# EAGLE design YOTSUBA_GNSS-receiver_MAX_ver.1.4.1 (EAGLE 9.6.2)
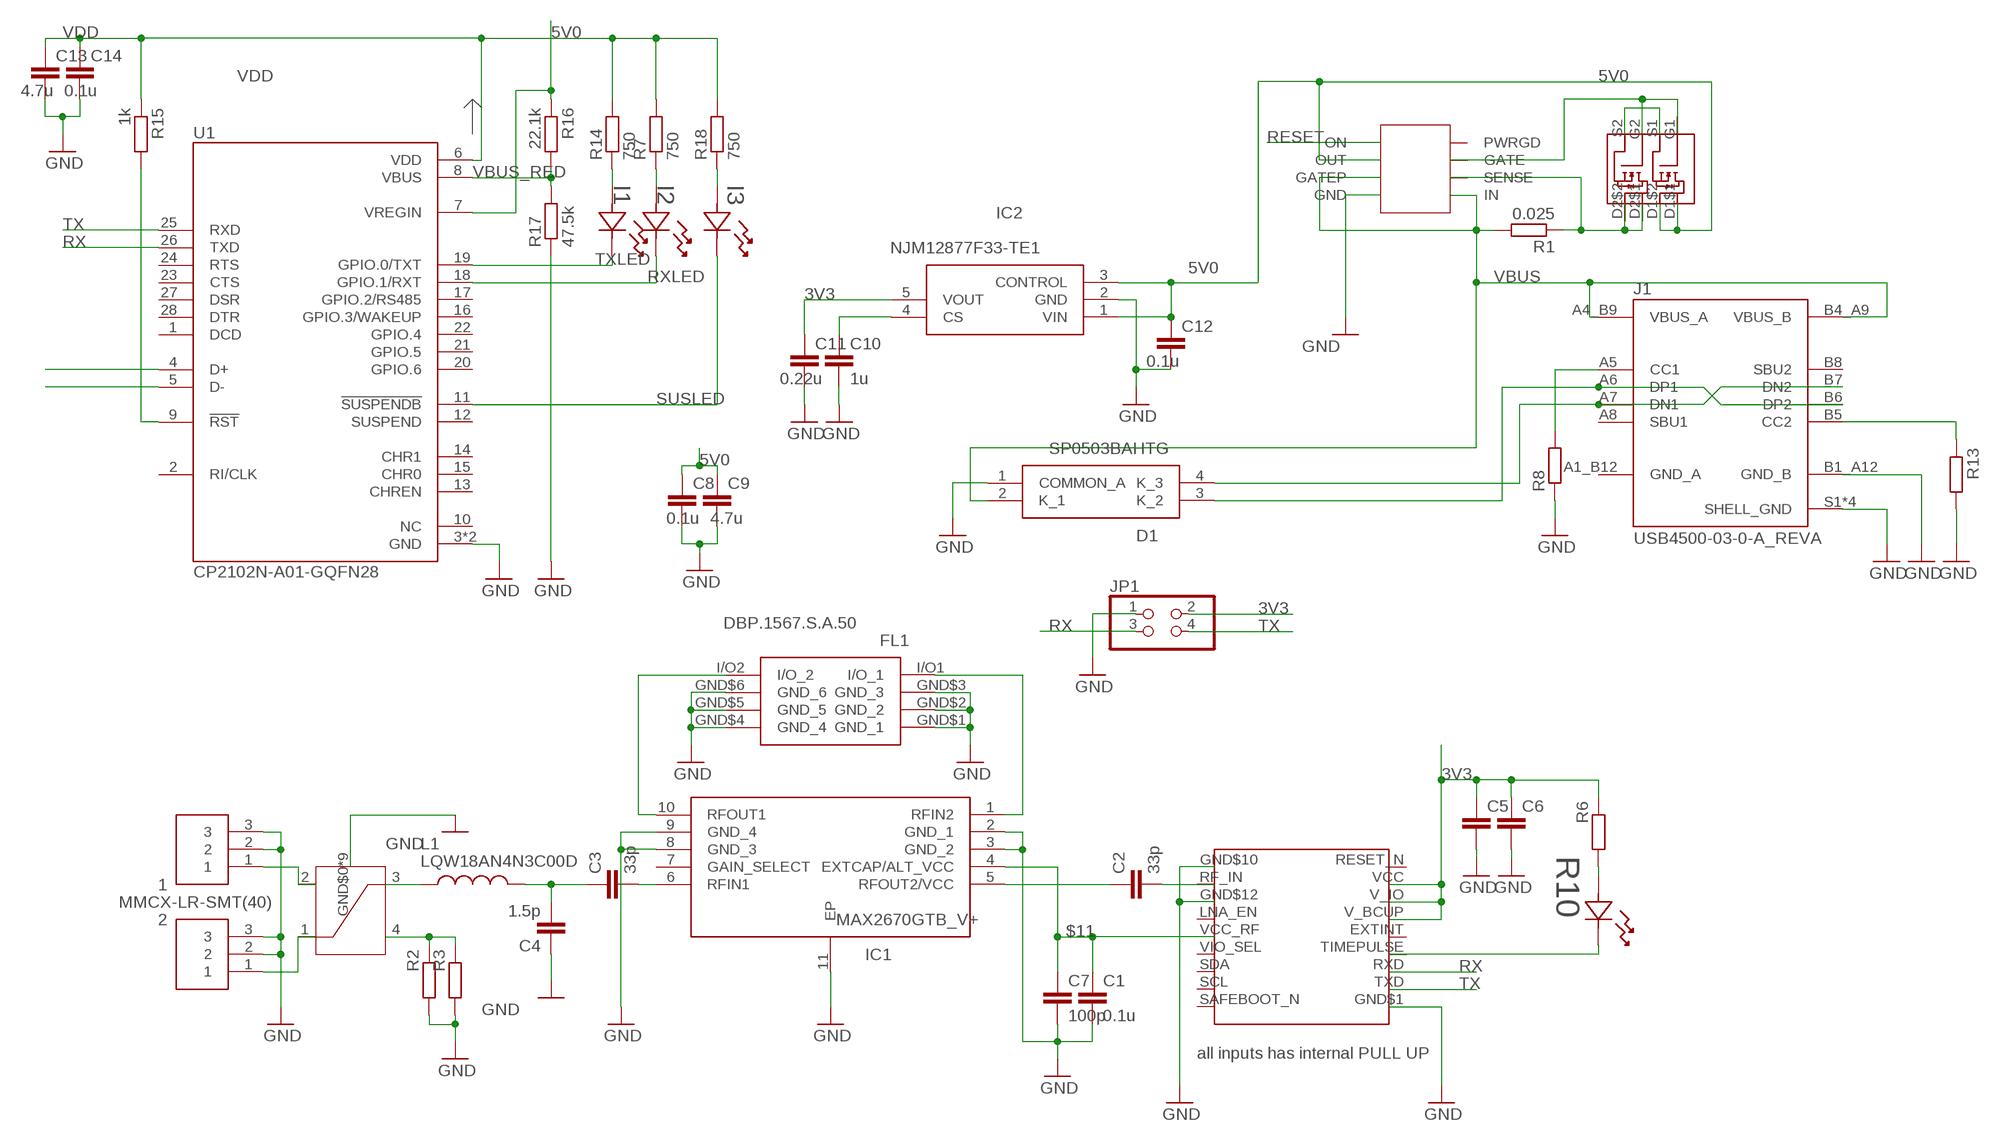
[diagram p0: schematic, sheet 1]

## Parts
1  MMCX-LR-SMT(40)  [MMCX-LR-SMT(40)]
2  MMCX-LR-SMT(40)  [MMCX-LR-SMT(40)]
C1  0.1u  C-EUC1608  [C1608]
C2  33p  C-EUC1608  [C1608]
C3  33p  C-EUC1608  [C1608]
C4  1.5p  C-EUC1608  [C1608]
C5  C-EUC1608  [C1608]
C6  C-EUC1608  [C1608]
C7  100p  C-EUC1608  [C1608]
C8  0.1u  C-EUC1608  [C1608]
C9  4.7u  C-EUC1608  [C1608]
C10  1u  C-EUC1608  [C1608]
C11  0.22u  C-EUC1608  [C1608]
C12  0.1u  C-EUC1608  [C1608]
C13  4.7u  C-EUC1608  [C1608]
C14  0.1u  C-EUC1608  [C1608]
D1  SP0503BAHTG  [SP0503BAHTG]
FL1  DBP.1567.S.A.50  [DBP1567SA50]
I1  SML-E12P8WT86  [LED_SMLD12_ROM]
I2  SML-E12P8WT86  [LED_SMLD12_ROM]
I3  SML-E12P8WT86  [LED_SMLD12_ROM]
IC1  MAX2670GTB_V+  [SON50P300X300X80-11N]
IC2  NJM12877F33-TE1  [SOT95P280X120-5N]
J1  USB4500-03-0-A_REVA  [GCT_USB4500-03-0-A_REVA]
JP1  PINHD-2X2  [2X02]
L1  LQW18AN4N3C00D  [INDC1608X100N]
R1  0.025  R-EU_R0603  [R0603]
R2  R-EU_R0603  [R0603]
R3  R-EU_R0603  [R0603]
R6  R-EU_R0603  [R0603]
R7  750  R-EU_R0603  [R0603]
R8  R-EU_R0603  [R0603]
R10  SML-E12P8WT86  [LED_SMLD12_ROM]
R13  R-EU_R0603  [R0603]
R14  750  R-EU_R0603  [R0603]
R15  1k  R-EU_R0603  [R0603]
R16  22.1k  R-EU_R0603  [R0603]
R17  47.5k  R-EU_R0603  [R0603]
R18  750  R-EU_R0603  [R0603]
U1  CP2102N-A01-GQFN28  [QFN50P500X500X80-29N]
U$1  MAX_M10S  [MAX-M10S]
U$3  HC125.A  [HC125.A]
U$7  DMG6898LSD  [SOIC127P600X150-8N]
U$8  LTC4361  [SOP65P280X100-8N]

## Nets
3V3 [POWER]: C5.1 C6.1 C11.1 IC2.5(VOUT) JP1.2 R6.2 U$1.V_BCUP(V_BCKP) U$1.V_IO U$1.VCC
5V0 [POWER]: C8.1 C9.1 C12.1 IC2.1(VIN) IC2.3(CONTROL) R16.1 U1.7(VREGIN) U$7.D1$1 U$7.D1$2 U$8.OUT
$11 [POWER]: C1.1 C7.1 IC1.4(EXTCAP/ALT_VCC) U$1.VCC_RF
D+: D1.3(K_2) J1.A6(DP1) J1.B6(DP2) U1.4(D+)
D-: D1.4(K_3) J1.A7(DN1) J1.B7(DN2) U1.5(D-)
GND [gnd]: 1.2 1.3 2.2 2.3 C1.2 C4.1 C5.2 C6.2 C7.2 C8.2 C9.2 C10.2 C11.2 C12.2 C13.2 C14.2 D1.1(COMMON_A) FL1.GND$1(GND_1) FL1.GND$2(GND_2) FL1.GND$3(GND_3) FL1.GND$4(GND_4) FL1.GND$5(GND_5) FL1.GND$6(GND_6) IC1.2(GND_1) IC1.3(GND_2) IC1.8(GND_3) IC1.9(GND_4) IC1.11(EP) IC2.2(GND) J1.B1_A12(GND_B) J1.S1(SHELL_GND) J1.S2(SHELL_GND) J1.S3(SHELL_GND) J1.S4(SHELL_GND) JP1.1 R2.1 R3.1 R8.1 R13.2 R17.1 U1.3(GND) U1.29(GND) U$1.GND$1 U$1.GND$10 U$1.GND$12 U$3.GND$0(GND) U$3.GND$1(GND) U$3.GND$2(GND) U$3.GND$3(GND) U$3.GND$4(GND) U$3.GND$5(GND) U$3.GND$6(GND) U$3.GND$7(GND) U$3.GND$8(GND) U$8.GND
N$1 [1.1mm]: 1.1 U$3.2
N$2 [1.1mm]: 2.1 U$3.1
N$4: C10.1 IC2.4(CS)
N$5: I2.2 R7.1
N$6 [50Ω]: R2.2 R3.2 U$3.4
N$7: L1.1 U$3.3
N$8 [50Ω]: FL1.I/O2(I/O_2) IC1.10(RFOUT1)
N$9 [50Ω]: FL1.I/O1(I/O_1) IC1.1(RFIN2)
N$10: C3.1 C4.2 L1.2
N$11 [50Ω]: C2.1 IC1.5(RFOUT2/VCC)
N$12 [50Ω]: C2.2 U$1.RF_IN
N$13: I1.2 R14.1
N$14: R10.1 U$1.TIMEPULSE
N$15: R6.1 R10.2
N$16: I3.2 R18.1
N$18: C3.2 IC1.6(RFIN1)
N$19: U$7.S1 U$7.S2
N$20: R1.1 U$7.D2$1 U$7.D2$2 U$8.SENSE
N$21: J1.B5(CC2) R13.1
N$22: U$7.G1 U$7.G2 U$8.GATE
N$23: J1.A5(CC1) R8.2
N$27: R15.2 U1.9(!RST)
RESET [gnd]: U$8.ON
RX: JP1.3 U1.26(TXD) U$1.RXD
RXLED: I2.1 U1.18(GPIO.1/RXT)
SUSLED: I3.1 U1.11(!SUSPENDB)
TX: JP1.4 U1.25(RXD) U$1.TXD
TXLED: I1.1 U1.19(GPIO.0/TXT)
VBUS: D1.2(K_1) J1.A4_B9(VBUS_A) J1.B4_A9(VBUS_B) R1.2 U$8.GATEP U$8.IN
VBUS_RED: R16.2 R17.2 U1.8(VBUS)
VDD: C13.1 C14.1 R7.2 R14.2 R15.1 R18.2 U1.6(VDD)
Unconnected: IC1.7(GAIN_SELECT) J1.A8(SBU1) J1.B8(SBU2) U1.1(DCD) U1.2(RI/CLK) U1.10(NC) U1.12(SUSPEND) U1.13(CHREN) U1.14(CHR1) U1.15(CHR0) U1.16(GPIO.3/WAKEUP) U1.17(GPIO.2/RS485) U1.20(GPIO.6) U1.21(GPIO.5) U1.22(GPIO.4) U1.23(CTS) U1.24(RTS) U1.27(DSR) U1.28(DTR) U$1.EXTINT U$1.LNA_EN U$1.RESET_N U$1.SAFEBOOT_N U$1.SCL U$1.SDA U$1.VIO_SEL U$8.PWRGD

## Notes on the sheet
- all inputs has internal PULL UP

## Power pins joined to a net without a drawn wire
GND: J1.A1_B12(GND_A)

## Library data of the parts
1 2 = MMCX-LR-SMT(40):MMCX-LR-SMT(40)
C1-C14 = rcl:C-EU: CAPACITOR, European symbol; SPICEPREFIX: C
D1 = SamacSys_Parts:SP0503BAHTG: ESD Suppressors / TVS Diodes TVS AVAL DIODE SMT Source: Datasheet <https://nl.mouser.com/datasheet/2/240/Littelfuse_TVS_Diode_Array_SP05_Datasheet.pdf-777043.pdf>; ARROW_PART_NUMBER: SP0503BAHTG; ARROW_PRICE-STOCK: https://www.arrow.com/en/products/sp0503bahtg/littelfuse?region=europe; DESCRIPTION: ESD Suppressors / TVS Diodes TVS AVAL DIODE SMT; HEIGHT: 1.22mm; MANUFACTURER_NAME: LITTELFUSE; MANUFACTURER_PART_NUMBER: SP0503BAHTG; MOUSER_PART_NUMBER: 576-SP0503BAHTG; MOUSER_PRICE-STOCK: https://www.mouser.co.uk/ProductDetail/Littelfuse/SP0503BAHTG?qs=uD%2FdkN7XIa0NTYXwHdELYA%3D%3D
FL1 = DBP.1567.S.A.50:DBP.1567.S.A.50: Ceramic Filters Band Pass 1567.5MHz 1dB 50Ohm SMD 2Pin Source: Datasheet <https://www.taoglas.com/datasheets/DBP.1567.S.A.50.pdf>; DESCRIPTION: Ceramic Filters Band Pass 1567.5MHz 1dB 50Ohm SMD 2Pin; HEIGHT: 4.2mm; MANUFACTURER_NAME: Taoglas; MANUFACTURER_PART_NUMBER: DBP.1567.S.A.50
I1-I3 R10 = LED_1608_2:SML-E12P8WT86; COPYRIGHT: Copyright (C) 2023 Ultra Librarian. All rights reserved.; DIGI-KEY_PART_NUMBER_1: 511-1585-1-ND; DIGI-KEY_PART_NUMBER_2: 511-1585-2-ND; DIGI-KEY_PART_NUMBER_3: 511-1585-6-ND; MANUFACTURER_PART_NUMBER: SML-E12P8WT86; MFR_NAME: ROHM Semiconductor
IC1 = MAX2670GTB_V+:MAX2670GTB_V+: RF Amplifier GPS/GNSS Front End Amplifier Source: Datasheet <https://componentsearchengine.com/Datasheets/1/MAX2670GTB_V .pdf>; DESCRIPTION: RF Amplifier GPS/GNSS Front End Amplifier; HEIGHT: 0.8mm; MANUFACTURER_NAME: Analog Devices; MANUFACTURER_PART_NUMBER: MAX2670GTB/V+; MOUSER_PART_NUMBER: 700-MAX2670GTB/V+; MOUSER_PRICE-STOCK: https://www.mouser.com/Search/Refine.aspx?Keyword=700-MAX2670GTB%2FV%2B
IC2 = SamacSys_Parts:NJM12877F33-TE1: LDO Voltage Regulators LDO ADJ High Ripple 3.3V Vo 1% 200mA Source: Datasheet <https://datasheet.datasheetarchive.com/originals/distributors/Datasheets_SAMA/e828f6bebe4b9138c37698b69374413c.pdf>; DESCRIPTION: LDO Voltage Regulators LDO ADJ High Ripple 3.3V Vo 1% 200mA; HEIGHT: 1.2mm; MANUFACTURER_NAME: New Japan Radio; MANUFACTURER_PART_NUMBER: NJM12877F33-TE1; MOUSER_PART_NUMBER: 513-NJM12877F33-TE1; MOUSER_PRICE-STOCK: https://www.mouser.com/Search/Refine.aspx?Keyword=513-NJM12877F33-TE1
J1 = USB4500-03-0-A_REVA:USB4500-03-0-A_REVA; DESCRIPTION: USB-C (USB TYPE-C) USB 2.0 Receptacle Connector 24 (16+8 Dummy) Position Board Edge, Cutout; Surface Mount; Through Hole, Right Angle; DIGI-KEY_PART_NUMBER: 2073-USB4500-03-0-ATR-ND; MF: Global Connector Technology; MP: USB4500-03-0-A; PACKAGE: None; PURCHASE-URL: https://pricing.snapeda.com/search/part/USB4500-03-0-A/?ref=eda
JP1 = pinhead:PINHD-2X2: PIN HEADER
L1 = LQW18AN4N3C00D:LQW18AN4N3C00D: 2.3 NH +/-.1NH; DESCRIPTION: Inductor with Inductance: 4.3nH Tol. +/-0.2nH, Package: 0603 (1608); DIGIKEY_PART_NUMBER: 490-6896-2-ND; MF: Murata; MP: LQW18AN4N3C00D; PACKAGE: 1608 Murata; PURCHASE-URL: https://pricing.snapeda.com/search?q=LQW18AN4N3C00D&ref=eda
R1-R3 R6-R8 R13-R18 = rcl:R-EU_: RESISTOR, European symbol; SPICEPREFIX: R
U1 = CP2102N-A01-GQFN28:CP2102N-A01-GQFN28: USB Bridge, USB to UART USB 2.0 UART Interface 28-QFN (5x5) Check availability <https://pricing.snapeda.com/parts/CP2102N-A01-GQFN28/Silicon%20Labs/view-part?ref=eda>; AVAILABILITY: In Stock; DESCRIPTION: USB Bridge, USB to UART USB 2.0 UART Interface 28-QFN (5x5); MF: Silicon Labs; MP: CP2102N-A01-GQFN28; PACKAGE: QFN-28 Silicon Labs; PRICE: None; PURCHASE-URL: https://pricing.snapeda.com/search/part/CP2102N-A01-GQFN28/?ref=eda
U$1 = MAX-M10S:MAX_M10S
U$3 = HC125.A:HC125.A
U$7 = DMG6898LSD:DMG6898LSD
U$8 = ltc4361:LTC4361

## Net classes
0 default: clearance 0.121 mm
2 gnd: clearance 0.21 mm to class 1, clearance 0.254 mm
3 POWER: width 0.305 mm, clearance 0.025 mm
4 1.1mm: clearance 0.247 mm to class 1

## Board
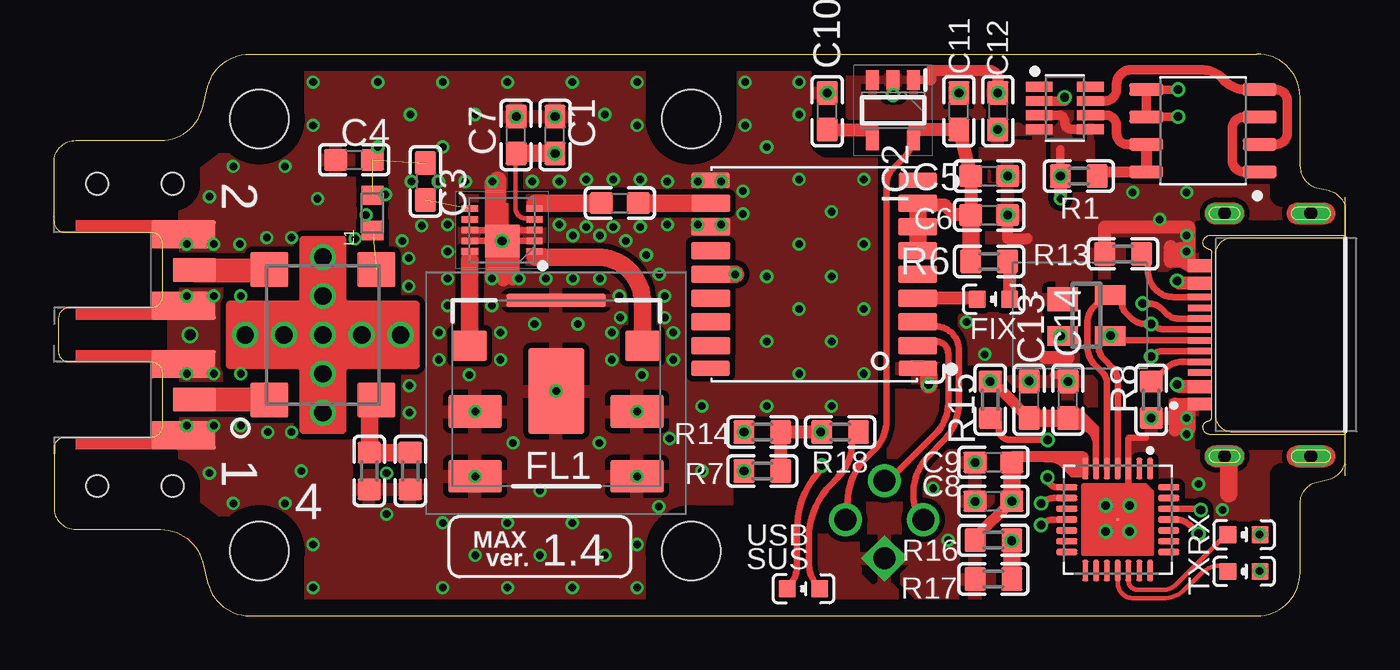
[diagram p1: board, top side]
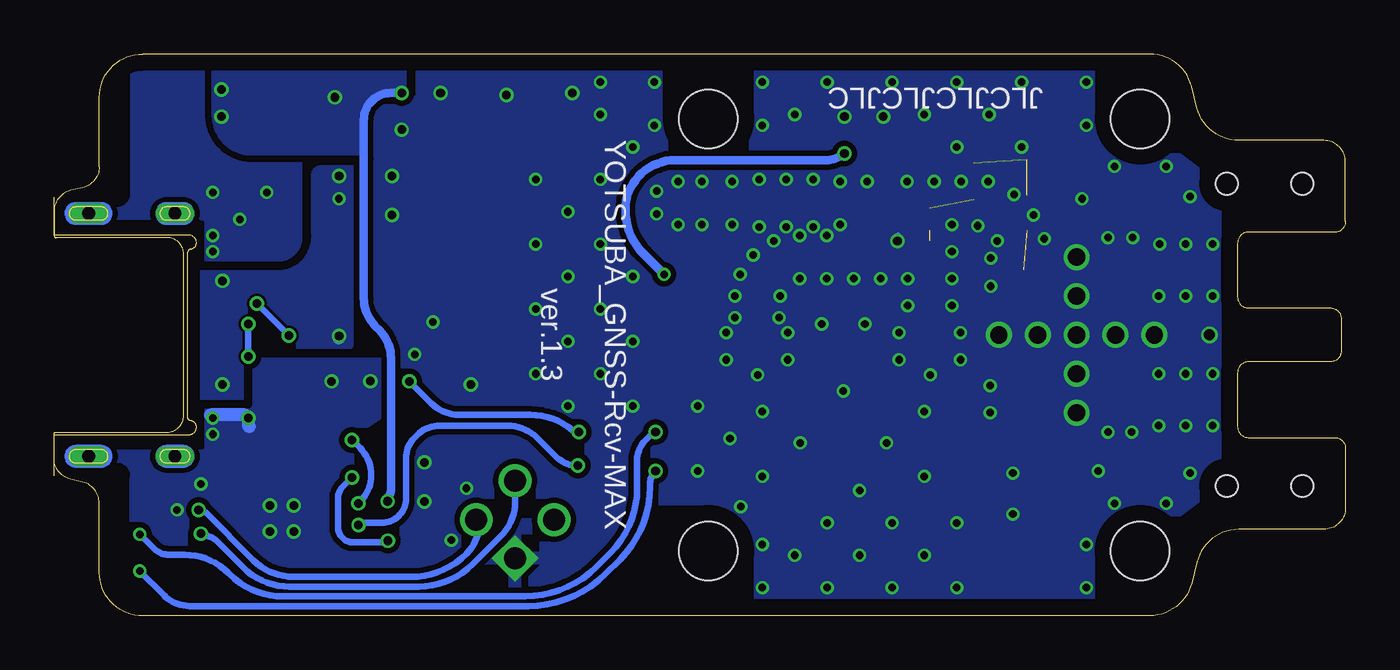
[diagram p2: board, bottom side, seen from below]

Size 59.8 x 26 mm. Coordinates in mm from the lower left corner, seen from the top.
Outline: 1,4 4.94,4 arc-76 6.88,2.48 7.12,1.51 arc76 9.06,0 55.7,0 arc90 57.7,2 57.7,5.21 arc-77 58.47,6.18 59.03,6.32 arc77 59.8,7.29 59.8,8.4 arc90 59.7,8.5 54.55,8.5 arc-90 53.8,9.25 53.8,16.75 arc-90 54.55,17.5 59.7,17.5 arc90 59.8,17.6 59.8,18.71 arc77 59.03,19.68 58.47,19.82 arc-77 57.7,20.79 57.7,24 arc90 55.7,26 9.06,26 arc76 7.12,24.48 6.88,23.52 arc-76 4.94,22 1,22 arc90 0,21 0,18.25 arc90 0.5,17.75 4.5,17.75 arc-90 5,17.25 5,14.75 arc-90 4.5,14.25 0.7,14.25 arc90 0.2,13.75 0.2,12.25 arc90 0.7,11.75 4.5,11.75 arc-90 5,11.25 5,8.75 arc-90 4.5,8.25 0.5,8.25 arc90 0,7.75 0,5 arc90 1,4
Copper layers (1+2*15+16): Top 0.035mm / dielectric 0.1mm / Route2 0.02mm / dielectric 0.77mm / Route15 0.02mm / dielectric 0.1mm / Bottom 0.035mm
Design rules "JLCPCB_2L *": minimum track width 5mil, minimum drill 0.15mm, track to track 5mil, track to pad 5mil, pad to pad 5mil, via to via 5mil, smd to smd 5mil, copper to edge 30mil, drill to drill 0.5mm, minimum pad ring 0.13mm, minimum via ring 0.13mm, stop-mask expansion 0.038mm, vias tented up to drill 0.4mm, thermal gap 10mil
Holes 1 mm at 2,6 5.5,6 2,20 5.5,20
Holes 2.7 mm at 9.5,3 9.5,23 29.5,23 29.5,3
tRestrict: 79 lines
bRestrict: 36 lines

### Footprints (pad centres in the part's own frame; a part is rotated, then mirrored left to right if it is on the bottom)
MMCX-LR-SMT(40) = smd 1.1 x 2: 1 0,-2 | smd 1.3 x 3: 2 1.65,-1.5; 3 -1.65,-1.5
C1608 = smd 1.1 x 1: 1 -0.85,0; 2 0.85,0
SP0503BAHTG = smd 1.1 x 1.4: 1 -0.75,-1.1 | smd 0.9 x 1.4: 2 0.95,-1.1; 3 0.95,1.1; 4 -0.95,1.1
DBP1567SA50 = smd 2.5 x 1.5: GND$1 1.05,6.75; GND$2 1.05,3.75; GND$4 8.55,3.75; GND$5 8.55,6.75 | smd 2.6 x 4: GND$3 4.8,2.8 | smd 4.6 x 0.6: GND$6 4.8,-1.4 | smd 1.6 x 1.4: I/O1 0.8,0.7; I/O2 8.8,0.7
LED_SMLD12_ROM = smd 0.8 x 0.8: 1 -0.75,0; 2 0.75,0
SON50P300X300X80-11N = smd 0.75 x 0.3: 1 -1.5,1; 2 -1.5,0.5; 3 -1.5,0; 4 -1.5,-0.5; 5 -1.5,-1; 6 1.5,-1; 7 1.5,-0.5; 8 1.5,0; 9 1.5,0.5; 10 1.5,1 | smd 1.6 x 1.5: 11 0,0.5
SOT95P280X120-5N = smd 0.9 x 0.6: 1 -1.4,0.95; 2 -1.4,0; 3 -1.4,-0.95; 4 1.4,-0.95; 5 1.4,0.95
GCT_USB4500-03-0-A_REVA = smd 0.6 x 1.1: A1_B12 -3.2,5.15; A4_B9 -2.4,5.15; B1_A12 3.2,5.15; B4_A9 2.4,5.15 | smd 0.3 x 1.1: A5 -1.25,5.15; A6 -0.25,5.15; A7 0.25,5.15; A8 1.25,5.15; B5 1.75,5.15; B6 0.75,5.15; B7 -0.75,5.15; B8 -1.75,5.15 | drill 0.6 pad 0.95 long: S1 -5.62,0; S4 5.62,0 | drill 0.6 pad 0.8 long: S2 5.62,4; S3 -5.62,4
2X02 = drill 1.016 square: 1 -1.27,-1.27 | drill 1.016: 2 -1.27,1.27; 3 1.27,-1.27; 4 1.27,1.27
INDC1608X100N = smd 0.89 x 1.02: 1 -0.814,0; 2 0.814,0
R0603 = smd 1 x 1.1: 1 -0.85,0; 2 0.85,0
QFN50P500X500X80-29N = smd 1.01 x 0.3: 1 -2.36,1.5; 2 -2.36,1; 3 -2.36,0.5; 4 -2.36,0; 5 -2.36,-0.5; 6 -2.36,-1; 7 -2.36,-1.5; 15 2.36,-1.5; 16 2.36,-1; 17 2.36,-0.5; 18 2.36,0; 19 2.36,0.5; 20 2.36,1; 21 2.36,1.5 | smd 0.3 x 1.01: 8 -1.5,-2.36; 9 -1,-2.36; 10 -0.5,-2.36; 11 0,-2.36; 12 0.5,-2.36; 13 1,-2.36; 14 1.5,-2.36; 22 1.5,2.36; 23 1,2.36; 24 0.5,2.36; 25 0,2.36; 26 -0.5,2.36; 27 -1,2.36; 28 -1.5,2.36 | smd 0.127 x 0.127: 29 0,0
MAX-M10S = smd 1.8 x 0.8: EXTINT 4.8,0; GND$12 -4.8,2.2; LNA_EN -4.8,1.1; RF_IN -4.8,3.3; RXD 4.8,-2.2; SCL -4.8,-3.3; SDA -4.8,-2.2; TIMEPULSE 4.8,-1.1; TXD 4.8,-3.3; V_BCUP 4.8,1.1; V_IO 4.8,2.2; VCC 4.8,3.3; VCC_RF -4.8,0; VIO_SEL -4.8,-1.1 | smd 1.8 x 0.7: GND$1 4.8,-4.35; GND$10 -4.8,4.35; RESET_N 4.8,4.35; SAFEBOOT_N -4.8,-4.35
HC125.A = smd 1.625 x 1.75: 1 -3.022,2.475; 2 3.022,2.475; 3 3.022,-2.475; 4 -3.022,-2.475 | drill 0.8: GND$0 0,0; GND$1 0,3.6; GND$2 0,1.8; GND$3 0,-3.6; GND$4 0,-1.8; GND$5 -3.6,0; GND$6 -1.8,0; GND$7 3.6,0; GND$8 1.8,0
SOIC127P600X150-8N = smd 1.58 x 0.589: D1$1 -2.625,1.905; D1$2 -2.625,0.635; D2$1 -2.625,-0.635; D2$2 -2.625,-1.905; G1 2.625,1.905; G2 2.625,-0.635; S1 2.625,0.635; S2 2.625,-1.905
SOP65P280X100-8N = smd 1.237 x 0.459: GATE 1.187,0.325; GATEP -1.187,-0.325; GND -1.187,-0.975; IN 1.187,-0.975; ON -1.187,0.975; OUT -1.187,0.325; PWRGD 1.187,0.975; SENSE 1.187,-0.325

### Placement (x,y rotation side)
1  4.5,16 90 top
2  4.5,10 90 top
C1  23.2,22.25 90 top
C2  26.2,19.1 0 top
C3  17.2,20.1 270 top
C4  13.9,21.1 0 top
C5  43.3,20.35 0 top
C6  43.3,18.55 0 top
C7  21.4,22.25 90 top
C8  43.5,5.3 180 top
C9  43.5,7.1 180 top
C10  35.8,23.35 90 top
C11  41.9,23.35 90 top
C12  43.7,23.35 270 top
C13  45.15,10 90 top
C14  46.95,10 90 top
D1  47.8,13.9 270 top
FL1  28.05,13.2 180 top
I1  55.1,3.75 0 top
I2  55.1,2.05 0 top
I3  34.7,1.25 0 top
IC1  20.75,17.85 180 top
IC2  38.85,23.4 270 top
J1  58.2,13 90 top
JP1  38.45,4.45 45 top
L1  14.75,18.65 90 top
R1  47.45,20.35 180 top
R2  14.6,6.7 90 top
R3  16.5,6.7 90 top
R6  43.3,16.4 180 top
R7  32.8,6.7 0 top
R8  50.8,10 90 top
R10  43.5,14.65 0 top
R13  49.5,16.75 180 top
R14  32.8,8.5 0 top
R15  43.35,10 270 top
R16  43.5,3.5 0 top
R17  43.5,1.7 0 top
R18  36.4,8.5 180 top
U1  49.25,4.45 270 top
U$1  35.2,15.8 0 top
U$3  12.45,13 90 top
U$7  53.2,22.45 0 top
U$8  46.8,23.5 0 top

### Tracks (layer width: path | path; a pad name or v marks a point on that pad's centre or on a via)
3V3
  Top 0.305: 36.54,4.57 JP1.2 arc45 36.65,4.93 36.75,5.17 36.75,5.23 arc-45 37.61,7.31 37.99,7.69 arc45 38.55,9.04 38.55,19.91 arc-45 38.89,20.74 39.43,21.28 arc45 39.65,21.81 39.65,21.85 IC2.5 39.8,22.15 39.75,22.2 39.75,22.25
  Top 0.6: U$1.VCC 40.1,19 41.25,19 41.7,18.55 C6.1 C5.1 C11.1 39.8,22.5 IC2.5
  Top 0.8: U$1.VCC U$1.V_IO U$1.V_BCUP | C6.1 R6.2
5V0  (via drill 0.4)
  Top 0.305: 44.35,7.35 C9.1 | 47.45,6.55 47.15,6.55 47.05,6.65 | 47.45,6.55 47.75,6.55 U1.7 47.75,7.25 47.65,7.35 | 46.95,6.75 46.67,7.03 arc45 46.14,7.25 46,7.25 45.9,7.35 | 46.95,6.75 47.05,6.65 | 47.45,6.55 47.45,7.3 47.4,7.35 | 47.15,7.35 47.15,6.75 47.05,6.65 | 46.95,7.4 46.95,6.75
  Top 0.4: R16.1 42.65,3.6 | U$7.D1$1 v52.05,24.36 | U$7.D1$2 52.05,23.09 v52.05,23.1 | IC2.1 40.6,24.8
  Top 0.45: U$7.D1$2 U$7.D1$1 | U$8.OUT 46.8,23.82 v46.8,24
  Top 0.5: 47.65,7.35 47.4,7.35 47.15,7.35 45.9,7.35 44.35,7.35 | IC2.1 39.79,24.9 | C8.1 42.65,3.6 | 40.6,24.8 40.6,25.24 43.28,25.24 arc-90 43.7,24.82 C12.1
  Top 0.8: C8.1 C9.1
  Bottom 0.4: C8.1 44.35,5.47 arc-45 44.2,5.83 44.2,11.93 arc-45 44.73,13.22 44.92,13.41 arc45 45.46,14.7 45.46,22.93 arc90 44.19,24.2 C12.1
  other vias: 44.35,5.3 43.7,24.2
  pour Bottom: 43.7,24.3 43.7,25.4 52.7,25.4 52.7,22.5 arc-90 51.7,21.5 45.5,21.5 45.5,23.3 arc90 44.5,24.3
  pour Top: 36.85,25.5 36.85,23.15 44.75,23.15 44.75,25.5
$11  (via drill 0.35, 0.4)
  Top 0.2: IC1.4 22.2,18.4 21.82,18.4 arc-90 21.37,18.85 21.37,21.4
  Top 0.305: 30.16,16.05 U$1.VCC_RF | 21.35,21.4 C7.1
  Top 0.6: 21.42,21.4 21.37,21.4 21.35,21.4
  Top 0.8: U$1.VCC_RF v31.55,15.8 | C1.1 21.42,21.4
  Bottom 0.4: C1.1 arc14 23.23,21.43 arc45 24.04,21.09 31.03,21.09 arc-90 33.34,18.77 arc-45 32.51,16.76 v31.55,15.8
  other vias: 23.2,21.4
D+  (via drill 0.4)
  Top 0.3: U1.4 49.25,10.89 arc45 48.99,11.51 48.63,11.87 arc-45 48.35,12.54 48.8,12.97 v48.92,12.97 | v48.92,12.97 D1.3 | v48.92,12.97 49.23,12.97 49.45,12.75 J1.A6 | J1.B6 52.09,13.75 arc-45 51.51,13.99 51.31,14.19 arc45 50.68,14.45 v50.4,14.45
  Bottom 0.3: v50.4,14.45 v48.92,12.97
D-  (via drill 0.4)
  Top 0.3: U1.5 48.75,10.77 arc45 48.54,11.27 48.2,11.61 arc-45 47.85,12.45 47.85,13.59 arc-45 48.14,14.29 48.7,14.85 D1.4 49.05,14.85 49.45,14.45 arc45 49.63,14.02 49.88,13.77 arc45 50.54,13.5 v50.8,13.5 50.76,13.54 arc45 51.46,13.25 J1.A7 | J1.B7 51.34,12.25 arc45 50.85,12.05 v50.8,12
  Bottom 0.3: v50.8,13.5 v50.8,12
GND  (via drill 0.35, 0.4, 0.5)  (1 unrouted)
  Top 0.152: IC1.11 20.7,17.35 20.28,17.77 20.2,17.77
  Top 0.3: C14.2 | C14.2 | v45.15,10.86 C13.2 | U1.3 49.75,5.15 v49.8,5.1 | 20.63,17.39 20.7,17.32 | IC1.9 IC1.11 | IC1.8 20.75,17.85 20.75,17.81
  Top 0.305: U1.3 49.75,8.2 49.8,8.25 50.55,8.25 | IC1.2 20.78,17.35 20.78,17.34 | IC1.3 20.75,17.85
  Top 0.4: 46.3,11.15 46.95,11.15 C14.2 46.95,11.95 | v18,4.3 18.05,4.35
  Top 0.45: IC2.2 v38.85,24.1 | U$1.GND$1 40.15,11.45 40.5,11.1
  Top 0.5: C6.2 44.15,17.45 45.05,17.45 | J1.S3 54.4,7.38
  Top 0.6: J1.B1_A12 52.55,16.2 52.35,16.4 51.7,16.4 51.7,16.85 52,16.85 52.15,17 52.35,16.8 52.35,16.36 52.54,16.36 52.54,18 48.65,18 R13.2 | 51.7,16.95 51.7,17.1 | C8.2 v42.65,5.29 | 46.95,11.95 45.9,11.95 | 52.6,9.8 51.9,9.8 51.9,8.6 | 52.6,9.8 J1.A1_B12 52.7,9.8 52.55,9.65 52.55,8.65 52.45,8.65 52.38,8.72 52.38,9.77 52.57,9.77 52.6,9.8 | IC1.11 20.25,16.85 20.25,15.6 | v20.27,15.6 20.25,15.62 20.25,15.69 | IC1.11 21.25,16.85 21.25,15.59 | 20.8,16.8 20.8,15.54 | IC1.11 20.75,17.45 20.65,17.55
  Top 0.8: 40.5,11.1 v40.5,10.7 | 20.78,17.34 20.75,17.81 | IC1.11 20.35,17.75 20.35,20.05 | 20.55,20.15 20.55,17.65 | 54.4,7.38 54.4,5.65
  Bottom 0.3: 50.75,8.75 50.8,8.7 | C14.2 | C14.2 | v45.15,10.86 45.09,10.86 45.05,10.9 | C6.2 44.2,18.6 | C12.2 43.75,22.5 | C11.2 41.85,24.25 | C10.2 35.75,24.15
  Bottom 0.305: C7.2 21.45,23.1 21.45,23.05 | C1.2 23.15,23.1 | IC1.11 20.72,17.35 20.72,17.59
  Bottom 0.6: v42.65,5.29 42.7,5.29 42.7,5.3 | C9.2 42.7,7.1 | 50.75,8.75 50.8,8.8 R8.1 50.95,9.3 52.55,9.3
  other vias: 12,24.7 12,1.3 12,3.3 12,22.7 10.7,20.8 8.3,20.8 10.7,5.2 8.3,5.2 6.15,14.8 6.15,11.2 6.15,17.2 6.15,8.8 6.3,13 7.2,19.4 7.2,6.6 11.45,6.7 12.2,19.3 49.8,3.9 48.7,3.9 48.7,5.1 42.65,7.1 46.95,10.85 44.15,20.35 44.15,18.55 43.7,22.5 41.9,24.2 35.8,24.2 50.8,9.15 52.45,9.15 53,6.1 42.25,13.6 43.1,12.1 40.7,5.9 21.4,23.1 23.2,23.1 20.75,17.35 20.3,20.1 13.95,17.45 41.4,3.5 18,1.3 21,1.3 24,1.3 27,1.3 19.5,2.8 22.5,2.8 25.5,2.8 21,4.3 24,4.3 27,3.3 15,24.7 18,24.7 21,24.7 24,24.7 27,24.7 16.5,23.2 19.5,23.2 25.5,23.2 27,22.7 18,21.7 15,21.7 22.5,5.8 32,24.7 33,21.7 34.5,20.2 37.5,20.2 36,18.7 37.5,17.2 34.5,17.2 34.5,14.2 36,15.7 37.5,14.2 36,12.7 33,12.7 33,15.7 34.5,11.2 37.5,11.2 33,9.7 30,9.7 30,6.7 28.5,8.2 16.45,9.4 23.25,10.4 19.5,9.45 19.5,6.45 27,6.45 27,9.45 32,22.7 34.5,23.2 28,5.05 22.25,13.5 24.25,13.5 25.25,8 21.25,8 36,9.7 22.15,20.1 23.4,20.1 24.65,20.2 19.05,20.1 17.8,20.1 16.55,20.1 23.4,18.1 24.65,18 25.9,18 25.9,20.2 27.15,20.2 28.4,20.1 27.15,18 28.4,18.1 29.8,20.1 30.9,20.1 29.8,18.1 30.9,18.1 24.02,17.6 25.27,17.6 24.02,15.6 22.77,15.6 21.52,15.6 20.27,14.35 18.23,15.6 18.23,14.35 18.23,16.85 18.23,18.1 25.27,15.6 26.23,13.8 28.27,13.8 28.02,15.8 27.43,16.7 26.48,17.35 28.27,14.8 26.18,14.8 31.9,18.6 31.9,19.65 17.02,18.05 16.12,17.35 14.45,18.55 15.35,19.5 17.82,13.1 20.68,13.1 17.82,11.85 20.68,11.85 25.82,13.1 28.68,13.1 25.82,11.85 28.68,11.85 16.43,16.55 16.43,15.25 16.45,10.65 19.23,11.15 27.23,11.15 7.4,17.2 8.6,17.2 7.4,14.8 8.65,14.8 7.4,11.2 8.65,11.2 7.4,8.8 8.65,8.8 9.85,17.5 9.9,8.5 11,17.5 11,8.5 34.5,24.7 54.1,4.9 52.45,8.4 52.45,16.85 52.45,17.6 52.45,19.6 51.2,18.35 49.95,19.6 15.4,6.6 15.4,4.7
  pour Top: -2.8,28.55 60.85,28.55 arc-90 61.85,27.55 61.85,-2.25 -2.8,-2.25
  pour Bottom: -1.75,27.65 60.8,27.65 60.8,-1.3 -1.75,-1.3
N$1
  Top 1.1: 1.1 9.9,16 9.93,15.97 U$3.2
N$2
  Top 1.1: U$3.1 9.95,10 2.1
N$3
  pour Top (no thermals): 19.65,18.7 19.65,19.5 18.75,19.5 18.75,18.7
N$4
  Top 0.6: 36,22.3 C10.1 37.9,22.5 IC2.4
N$5  (via drill 0.35, 0.4)
  Top 0.3: I2.2 v55.83,2.07
  Bottom 0.3: v55.83,2.07 54.7,0.94 arc-45 53.51,0.45 37.85,0.45 arc-45 34.27,1.94 33.6,2.6 arc-45 32.2,5.98 32.2,6.1 arc45 R7.1
  other vias: 31.95,6.7
N$6
  Top 0.8: U$3.4 14.62,9.68 14.62,7.53 R2.2 R3.2
N$7  (1 unrouted)
N$8
  Top 0.3: 19.25,16.44 IC1.10
  Top 0.8: 19.23,12.5 FL1.I/O2 19.25,16.44
  pour Top (no thermals): 19.65,16.4 19.65,17.05 18.85,17.05 18.85,16.4
N$9
  Top 0.3: 26.95,12.8 FL1.I/O1 | 22.3,16.6 22.25,16.6 IC1.1
  Top 0.8: 22.3,16.6 25.15,16.6 arc-90 27.25,14.5 FL1.I/O1
  pour Top (no thermals): 21.85,17 21.85,16.2 22.75,16.2 22.75,17
N$10  (2 unrouted)
N$11
  Top 0.3: 22.3,19.1 22.3,18.9 IC1.5
  Top 0.8: C2.1 22.3,19.1
  pour Top (no thermals): 21.85,19.5 22.7,19.5 22.7,18.7 21.85,18.7
N$12
  Top 0.8: U$1.RF_IN C2.2
N$13  (via drill 0.35, 0.4)
  Top 0.3: I1.2 v55.83,3.77
  Bottom 0.3: 55.79,3.82 55.79,3.81 v55.83,3.77 55.17,3.11 arc-45 54.47,2.82 53.74,2.82 arc45 51.74,1.99 51.68,1.93 arc-45 49.19,0.9 37.98,0.9 arc-45 34.69,2.26 34.03,2.92 arc-45 32.8,5.89 32.8,7.2 arc45 32.43,8.1 32.01,8.52 arc45 R14.1
  other vias: 31.95,8.5
N$14
  Top 0.6: R10.1 42.7,14.7 U$1.TIMEPULSE
N$15
  Top 0.6: R10.2 44.25,16.4 R6.1
N$16
  Top 0.3: I3.2 arc-45 34.95,2.46 34.95,3.61 arc-45 35.97,6.07 36.26,6.36 arc45 36.95,8.02 36.95,8.2 R18.1
N$18  (1 unrouted)
N$19
  Top 0.45: U$7.S1 55.1,23.09 arc90 54.55,22.54 54.55,21.09 arc90 55.1,20.55 U$7.S2
N$20
  Top 0.3: R1.1 48.09,20.55
  Top 0.45: U$8.SENSE 48.7,23.18 arc-90 49.2,22.68 49.2,22.32 arc90 49.7,21.82 U$7.D2$1
  Top 0.5: U$7.D2$1 U$7.D2$2 48.09,20.55
N$21
  Top 0.3: R13.1 50.55,16.75 50.65,16.65 50.65,15.99 arc45 51.03,15.09 arc45 51.84,14.75 51.85,14.75 J1.B5
N$22
  Top 0.45: U$8.GATE 48.65,23.82 arc90 49.2,24.38 49.2,24.61 arc-90 49.85,25.26 53.18,25.26 arc-45 54.08,24.89 54.24,24.73 arc45 55.14,24.36 U$7.G1 56.56,24.36 arc-90 57.11,23.8 57.11,22.36 arc-90 56.56,21.82 U$7.G2
N$23
  Top 0.3: J1.A5 52.21,11.75 arc45 51.51,11.46 51.2,11.15 51.1,11.15 R8.2
N$27  (via drill 0.4)
  Top 0.3: U1.9 46.3,5.45 arc45 v45.7,5.2 | v46.01,8.14 44.26,8.14 arc-90 43.75,8.65 43.75,8.95 43.55,9.15 R15.2
  Bottom 0.3: 45.75,5.25 v45.7,5.2 45.61,5.29 arc-45 45.11,6.5 arc-45 45.64,7.77 v46.01,8.14
RX  (via drill 0.4)
  Top 0.3: v53.1,4.9 arc45 52.98,4.95 U1.26 | U$1.RXD 40.2,13.4 40.8,13.4 arc-90 41.9,12.3 41.9,9.87 arc-45 41.14,8.04 40.49,7.39 arc45 39.8,5.72 39.8,5.54 arc45 JP1.3
  Bottom 0.3: v53.1,4.9 arc45 52.76,4.76 50.57,2.57 arc-45 48.71,1.8 43.28,1.8 arc-45 40.7,2.87 arc-45 40.1,4.31 JP1.3
RXLED
  Top 0.2: U1.18 49.25,1.53 arc90 49.97,0.81 51.36,0.81 arc45 52.37,1.23 53.05,1.91 arc-45 54.07,2.33 I2.1
SUSLED  (via drill 0.4)
  Top 0.3: U1.11 46.27,4.45 arc45 45.7,4.21 v45.7,4.2 | I3.1 33.95,1.35 34.1,1.5 arc45 34.4,2.23 34.4,4.03 arc-45 35.55,6.81 v35.55,6.95
  Bottom 0.3: v35.55,6.95 arc45 36.57,7.37 37.43,8.24 arc-45 38.8,8.8 41.92,8.8 arc-45 42.99,8.36 43.11,8.24 arc-45 43.5,7.29 43.5,5.42 arc90 44.62,4.3 45.46,4.3 arc-45 v45.7,4.2
TX  (via drill 0.4)
  Top 0.3: U1.25 51.94,4.45 arc-45 52.64,4.16 v53,3.8 | JP1.4 38.65,6.25 40.82,8.42 arc45 41.4,9.83 41.4,11.03 41.4,12.15 arc90 40.85,12.7 40.2,12.7 U$1.TXD
  Bottom 0.3: v53,3.8 52.91,3.71 arc45 52.23,3.43 51.05,2.25 arc-45 48.88,1.35 42.91,1.35 arc-45 40.41,2.38 39.12,3.68 arc-45 38.45,5.29 JP1.4
TXLED
  Top 0.2: U1.19 49.75,1.62 arc90 50.17,1.2 51.35,1.2 arc45 51.94,1.44 54.18,3.68
  Top 0.3: I1.1 54.28,3.68 54.18,3.68
VBUS  (via drill 0.35, 0.4)
  Top 0.3: J1.A4_B9 53.04,10.59 52.96,10.59 | D1.2 v46.6,12.95
  Top 0.4: 46.6,21.6 R1.2
  Top 0.45: U$8.GATEP 46.5,23.18 arc-90 46.8,22.88 46.8,22.82 arc90 47.1,22.52 U$8.IN
  Top 0.5: R1.2
  Top 0.6: J1.A4_B9 52.1,10.6 v52,10.7 | J1.B4_A9 52.1,15.4 v52,15.5 | R1.2 v46.6,19.3
  Bottom 0.6: 46.6,12.85 v46.6,12.95
  other vias: 46.6,20.35
  pour Bottom: 53.15,9.95 51.1,9.95 51.1,12.5 46.15,12.5 46.1,12.55 46.1,21 47.37,21 arc-90 47.75,20.61 47.75,17.62 arc90 49.02,16.35 53.15,16.35
  pour Top: 46.1,23.25 48.05,23.25 48.05,20.4 46.1,20.4
VBUS_RED  (via drill 0.4)
  Top 0.3: U1.8 46.45,5.95 arc-90 v46,6.4
  Top 0.4: R16.2 v44.35,3.48 v44.34,3.47
  Top 0.8: R16.2 R17.2
  Bottom 0.3: 44.42,3.4 45.95,3.4 arc90 46.65,4.1 46.65,5.44 arc45 46.43,5.97 v46,6.4
  Bottom 0.406: v44.34,3.47 44.42,3.4
VDD  (via drill 0.4)
  Top 0.3: U1.6 48.25,7.9 arc90 47.39,8.76 47.5,8.76 | C14.1 46.95,9.45 47.5,9.45 | 47.5,9.45 47.8,9.15 | 47.8,9.15 48.2,8.75 | 48.2,8.75 arc90 48.25,8.7 48.25,7.85 | 47.5,9.45 47.5,8.76 | 47.5,8.76 47.5,8.75 47.8,8.75 | 47.8,8.75 48.2,8.75 | 47.8,9.15 47.8,8.75
  Top 0.305: 47.39,8.76 47.34,8.76 C14.1
  Top 0.4: R18.2 v35.5,8.5
  Top 0.5: C13.1 43.82,10.48 43.38,10.85 R15.1
  Top 0.6: R7.2 R14.2 R18.2
  Top 0.8: C13.1 C14.1
  Bottom 0.3: v35.5,8.5 35.59,8.41 arc-45 37.75,9.3 41.04,9.3 arc45 42.34,9.84 R15.1
  other vias: 43.35,10.85

### Text on the board
tPlace: 2 | FIX | 1 | 4 | MAX | USB | RX | ver. | 1.4 | SUS | TX
bPlace: YOTSUBA_GNSS-Rcv-MAX | ver.1.3
bNames: JLCJLCJLCJLC